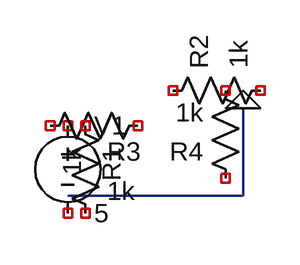
[diagram p0: schematic circuit.asc]
circuit.asc, the LTspice schematic file:
Version 4
SHEET 1 880 680
WIRE 100 180 260 180
WIRE 260 180 260 100
SYMBOL voltage 100 100 R0
SYMATTR InstName V1
SYMATTR Value 5
SYMBOL res 180 100 R90
SYMATTR InstName R1
SYMATTR Value 1k
SYMBOL res 180 100 R270
SYMATTR InstName R2
SYMATTR Value 1k
SYMBOL res 100 100 R0
SYMATTR InstName R3
SYMATTR Value 1k
SYMBOL res 260 180 R180
SYMATTR InstName R4
SYMATTR Value 1k
FLAG 260 100 0

The netlist it stands for:
* circuit.asc
V1 NC_01 NC_02 5
R1 NC_03 NC_04 1k
R2 NC_05 NC_06 1k
R3 NC_07 NC_08 1k
R4 NC_09 NC_10 1k
.backanno
.end